# EasyEDA schematic Jafar-SE - EasyEDA - Schematic Export.json
TITLE: Jafar Chip - Socket Edition; REV: 5.0; Date: 09-11-2024; Sheet: 1/1; Drawn By: Tony Kuberka; Company: TK's Custom Super Modz LLC
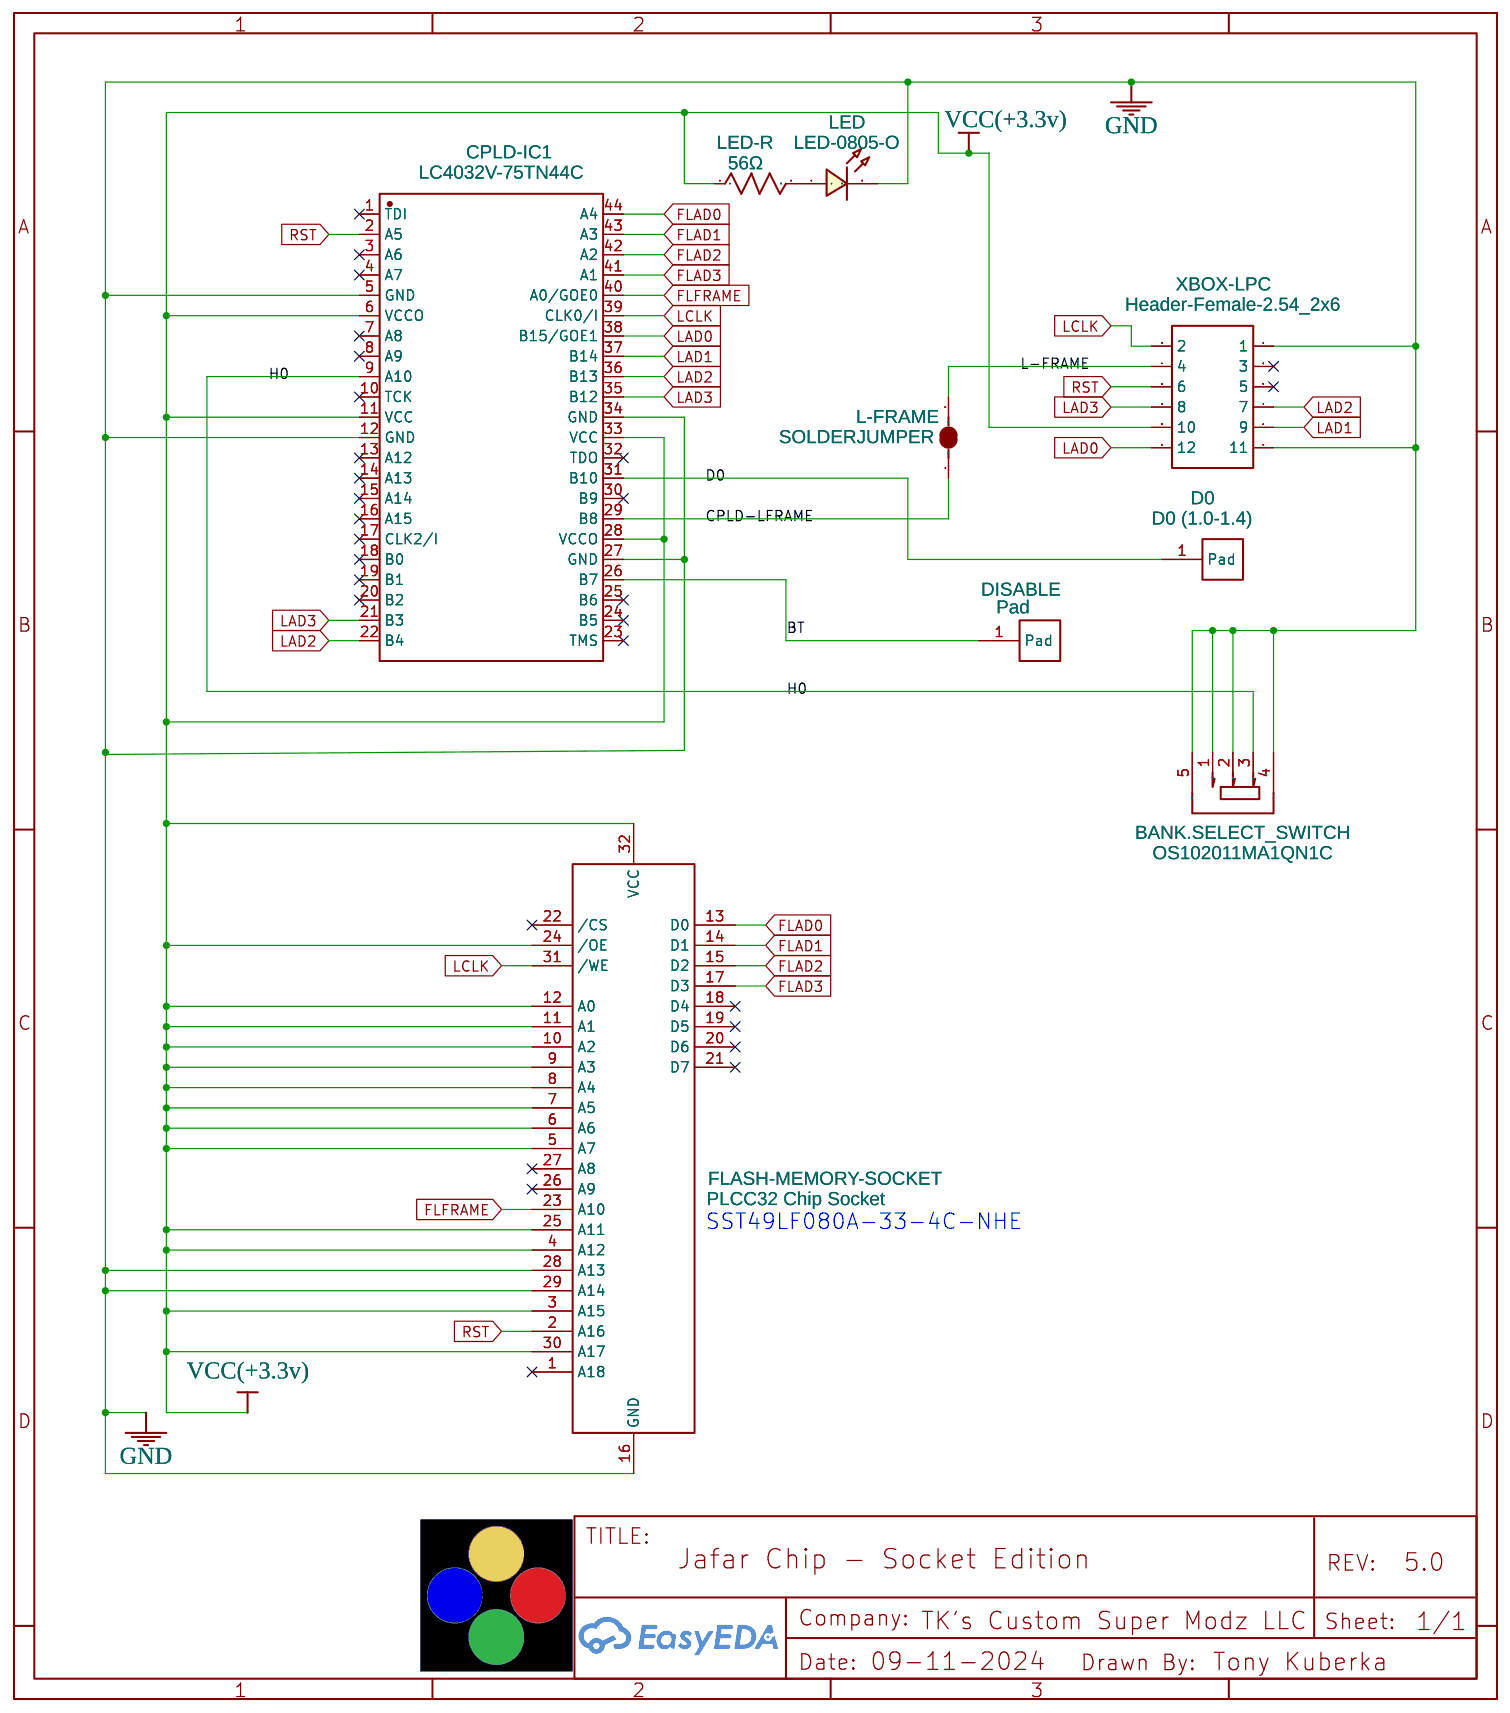
[diagram p0: schematic sheet]

## Parts
BANK.SELECT_SWITCH  OS102011MA1QN1C  [SW-TH_OS102011MA1QN1C]
CPLD-IC1  LC4032V-75TN44C  [TQFP-44_L10.0-W10.0-P0.80-LS12.0-BL]
D0  D0 (1.0-1.4)  [PADPAD]
DISABLE  Pad  [PADPAD]
FLASH-MEMORY-SOCKET  PLCC32 Chip Socket  [PLCC32MS]
L-FRAME  SOLDERJUMPER  [SJ_2S-NOTRACE]
LED  LED-0805-O  [LED-0805-ORANGE]
LED-R  56Ω  [R0805]
XBOX-LPC  Header-Female-2.54_2x6  [HDR-TH_12P-P2.54-V-F-R2-C6-S2.54]

## Library data of the parts
BANK.SELECT_SWITCH = OS102011MA1QN1C: Supplier: LCSC; Supplier Part: C221828; Manufacturer: C&K; Contributor: LCSC; JLCPCB Part Class: Extended Part
CPLD-IC1 = LC4032V-75TN44C: Supplier: LCSC; Supplier Part: C1521108; Manufacturer: LATTICE(莱迪思); Contributor: LCSC; JLCPCB Part Class: Extended Part
D0 DISABLE = SOLDER PAD: Contributor: Tellon
FLASH-MEMORY-SOCKET = SST39VF040-70-4C-NHE: Manufacturer: Microchip Technology; Supplier: Mouser; Supplier Part: 804-39VF0407CNHE; Contributor: KyleCardoza
L-FRAME = SOLDERJUMPER-OLDNC2: Solder Jumper; Contributor: SparkFun
LED = LED-0805-ORANGE: Manufacturer: Yongyu Photoelectric; Manufacturer Part: SZYY0805O; Supplier: LCSC; Supplier Part: C434437; link: https://datasheet.lcsc.com/lcsc/1912111437_Yongyu-Photoelectric-SZYY0805O_C434437.pdf; Contributor: ajkuberka; Package Display: No
LED-R = R_0805_US: Contributor: LCEDA_Lib
XBOX-LPC = Header-Female-2.54_2x6: Supplier: LCSC; Manufacturer: BOOMELE(博穆精密); Manufacturer Part: 2.54-2*6P母; Supplier Part: C36191; JLCPCB Part Class: Extended Part

## Nets
GND: BANK.SELECT_SWITCH.1 BANK.SELECT_SWITCH.2 BANK.SELECT_SWITCH.4 BANK.SELECT_SWITCH.5 CPLD-IC1.5(GND) CPLD-IC1.12(GND) CPLD-IC1.27(GND) CPLD-IC1.34(GND) FLASH-MEMORY-SOCKET.16(GND) FLASH-MEMORY-SOCKET.28(A13) FLASH-MEMORY-SOCKET.29(A14) LED.2 XBOX-LPC.1 XBOX-LPC.11
VCC(+3.3v): CPLD-IC1.6(VCCO) CPLD-IC1.11(VCC) CPLD-IC1.28(VCCO) CPLD-IC1.33(VCC) FLASH-MEMORY-SOCKET.3(A15) FLASH-MEMORY-SOCKET.4(A12) FLASH-MEMORY-SOCKET.5(A7) FLASH-MEMORY-SOCKET.6(A6) FLASH-MEMORY-SOCKET.7(A5) FLASH-MEMORY-SOCKET.8(A4) FLASH-MEMORY-SOCKET.9(A3) FLASH-MEMORY-SOCKET.10(A2) FLASH-MEMORY-SOCKET.11(A1) FLASH-MEMORY-SOCKET.12(A0) FLASH-MEMORY-SOCKET.24(/OE) FLASH-MEMORY-SOCKET.25(A11) FLASH-MEMORY-SOCKET.30(A17) FLASH-MEMORY-SOCKET.32(VCC) LED-R.1 XBOX-LPC.10
BT: CPLD-IC1.26(B7) DISABLE.1(Pad)
CPLD-LFRAME: CPLD-IC1.29(B8) L-FRAME.1
D0: CPLD-IC1.31(B10) D0.1(Pad)
FLAD0: CPLD-IC1.44(A4) FLASH-MEMORY-SOCKET.13(D0)
FLAD1: CPLD-IC1.43(A3) FLASH-MEMORY-SOCKET.14(D1)
FLAD2: CPLD-IC1.42(A2) FLASH-MEMORY-SOCKET.15(D2)
FLAD3: CPLD-IC1.41(A1) FLASH-MEMORY-SOCKET.17(D3)
FLFRAME: CPLD-IC1.40(A0/GOE0) FLASH-MEMORY-SOCKET.23(A10)
H0: BANK.SELECT_SWITCH.3 CPLD-IC1.9(A10)
L-FRAME: L-FRAME.2 XBOX-LPC.4
LAD0: CPLD-IC1.38(B15/GOE1) XBOX-LPC.12
LAD1: CPLD-IC1.37(B14) XBOX-LPC.9
LAD2: CPLD-IC1.22(B4) CPLD-IC1.36(B13) XBOX-LPC.7
LAD3: CPLD-IC1.21(B3) CPLD-IC1.35(B12) XBOX-LPC.8
LCLK: CPLD-IC1.39(CLK0/I) FLASH-MEMORY-SOCKET.31(/WE) XBOX-LPC.2
RST: CPLD-IC1.2(A5) FLASH-MEMORY-SOCKET.2(A16) XBOX-LPC.6
Net-(LED-1): LED.1 LED-R.2

Not connected (* = marked no-connect by the designer): CPLD-IC1 1(TDI)* 3(A6)* 4(A7)* 7(A8)* 8(A9)* 10(TCK)* 13(A12)* 14(A13)* 15(A14)* 16(A15)* 17(CLK2/I)* 18(B0)* 19(B1)* 20(B2)* 23(TMS)* 24(B5)* 25(B6)* 30(B9)* 32(TDO)*; FLASH-MEMORY-SOCKET 1(A18)* 18(D4)* 19(D5)* 20(D6)* 21(D7)* 22(/CS)* 26(A9)* 27(A8)*; XBOX-LPC 3* 5*

## Notes on the sheet
- SST49LF080A-33-4C-NHE
